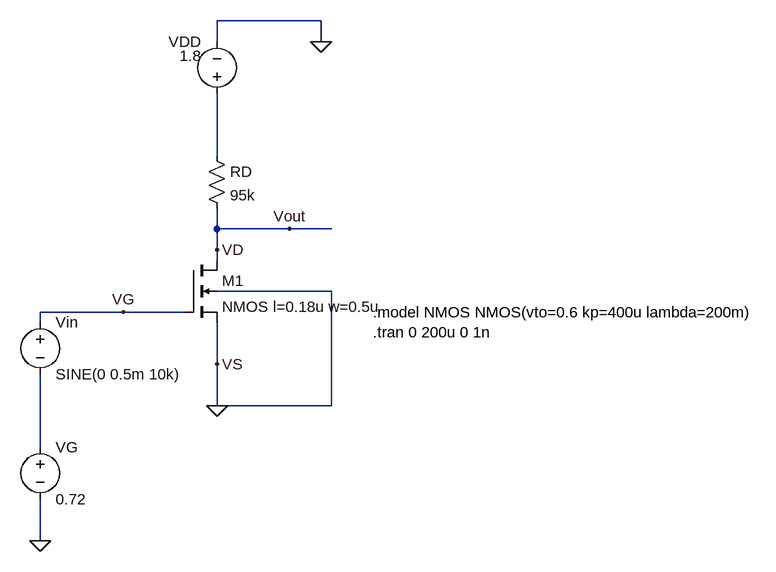
[diagram p0: schematic Draft7.asc]
Draft7.asc, the LTspice schematic file:
Version 4
SHEET 1 880 816
WIRE -160 0 -320 0
WIRE -320 32 -320 0
WIRE -160 32 -160 0
WIRE -320 208 -320 112
WIRE -320 320 -320 288
WIRE -208 320 -320 320
WIRE -144 320 -208 320
WIRE -320 352 -320 320
WIRE -320 368 -320 352
WIRE -144 416 -320 416
WIRE -464 448 -592 448
WIRE -368 448 -464 448
WIRE -592 464 -592 448
WIRE -320 528 -320 464
WIRE -320 592 -320 528
WIRE -144 592 -144 416
WIRE -144 592 -320 592
WIRE -592 656 -592 544
WIRE -592 800 -592 736
FLAG -320 592 0
FLAG -592 800 0
FLAG -160 32 0
FLAG -208 320 Vout
FLAG -320 528 VS
FLAG -464 448 VG
FLAG -320 352 VD
SYMBOL voltage -320 128 R180
WINDOW 0 24 96 Left 2
WINDOW 3 24 74 Left 2
SYMATTR InstName VDD
SYMATTR Value 1.8
SYMBOL Res -336 192 R0
SYMATTR InstName RD
SYMATTR Value 95k
SYMBOL nmos4 -368 368 R0
SYMATTR InstName M1
SYMATTR Value NMOS l=0.18u w=0.5u
SYMBOL Voltage -592 448 R0
SYMATTR InstName Vin
SYMATTR Value SINE(0 0.5m 10k)
SYMBOL Voltage -592 640 R0
SYMATTR InstName VG
SYMATTR Value 0.72
TEXT -80 448 Left 2 !.model NMOS NMOS(vto=0.6 kp=400u lambda=200m)\n.tran 0 200u 0 1n

The netlist it stands for:
* Draft7.asc
VDD N001 0 1.8
RD N001 VD 95k
M1 VD VG 0 0 NMOS l=0.18u w=0.5u
Vin VG N002 SINE(0 0.5m 10k)
VG N002 0 0.72
.model NMOS NMOS
.model PMOS PMOS
.lib standard.mos
.model NMOS NMOS(vto=0.6 kp=400u lambda=200m)
.tran 0 200u 0 1n
.backanno
.end